# EAGLE design c64_mouse (EAGLE 9.6.2)
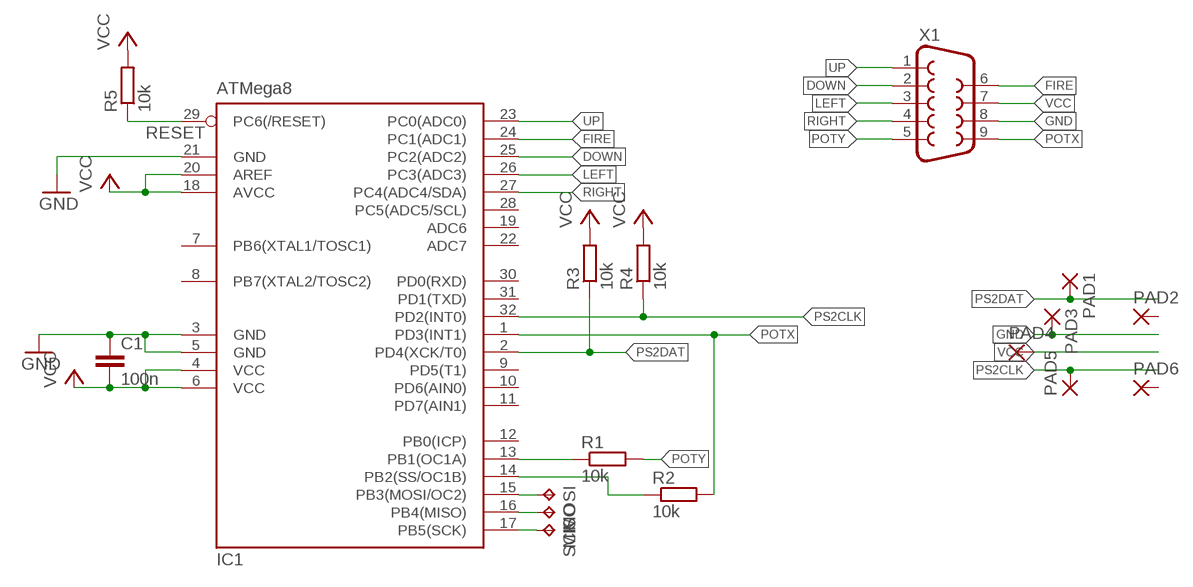
[diagram p0: schematic, sheet 1]

## Parts
C1  100n  C-EUC0805  [C0805]
IC1  ATMega8  MEGA8-AI  [TQFP32-08]
MISO  TPB1,27  [B1,27]
MOSI  TPB1,27  [B1,27]
PAD1  SMD2  [SMD1,27-2,54]
PAD2  SMD2  [SMD1,27-2,54]
PAD3  SMD2  [SMD1,27-2,54]
PAD4  SMD2  [SMD1,27-2,54]
PAD5  SMD2  [SMD1,27-2,54]
PAD6  SMD2  [SMD1,27-2,54]
R1  10k  R-EU_R0805  [R0805]
R2  10k  R-EU_R0805  [R0805]
R3  10k  R-EU_R0805  [R0805]
R4  10k  R-EU_R0805  [R0805]
R5  10k  R-EU_R0805  [R0805]
SCK  TPB1,27  [B1,27]
X1  F09D  [F09D]

## Nets
DOWN: IC1.25(PC2(ADC2)) X1.2
FIRE: IC1.24(PC1(ADC1)) X1.6
GND: C1.1 IC1.3(GND) IC1.5(GND) IC1.21(GND) PAD3.1(P) X1.8
LEFT: IC1.26(PC3(ADC3)) X1.3
N$2: IC1.15(PB3(MOSI/OC2)) MOSI.TP
N$3: IC1.16(PB4(MISO)) MISO.TP
N$4: IC1.17(PB5(SCK)) SCK.TP
N$7: IC1.13(PB1(OC1A)) R1.1
N$8: IC1.14(PB2(SS/OC1B)) R2.1
POTX: IC1.1(PD3(INT1)) R2.2 X1.9
POTY: R1.2 X1.5
PS2CLK: IC1.32(PD2(INT0)) PAD5.1(P) R4.1
PS2DAT: IC1.2(PD4(XCK/T0)) PAD1.1(P) R3.1
RESET: IC1.29(PC6(/RESET)) R5.1
RIGHT: IC1.27(PC4(ADC4/SDA)) X1.4
UP: IC1.23(PC0(ADC0)) X1.1
VCC: C1.2 IC1.4(VCC) IC1.6(VCC) IC1.18(AVCC) IC1.20(AREF) PAD4.1(P) R3.2 R4.2 R5.2 X1.7
Unconnected: IC1.7(PB6(XTAL1/TOSC1)) IC1.8(PB7(XTAL2/TOSC2)) IC1.9(PD5(T1)) IC1.10(PD6(AIN0)) IC1.11(PD7(AIN1)) IC1.12(PB0(ICP)) IC1.19(ADC6) IC1.22(ADC7) IC1.28(PC5(ADC5/SCL)) IC1.30(PD0(RXD)) IC1.31(PD1(TXD)) PAD2.1(P) PAD6.1(P)

## Library data of the parts
C1 = rcl:C-EU: CAPACITOR, European symbol; SPICEPREFIX: C
IC1 = atmel:MEGA8: MICROCONTROLLER 8 Kbytes FLASH, 1 kbytes SRAM, 512 bytes EEPROM, USART, 6-channel 10 bit ADC, 2-channel 8 bit ADC Pin compatible with Atmega48, ATMega88, ATMega168 Source: avr.lbr; MPN: ATMEGA8-16AU; OC_FARNELL: 9171371; OC_NEWARK: 73M8863
MISO MOSI SCK = testpad:TP: Test pad
PAD1-PAD6 = wirepad:SMD2: SMD PAD
R1-R5 = rcl:R-EU_: RESISTOR, European symbol; SPICEPREFIX: R
X1 = con-subd-edit:F09: SUB-D; OC_FARNELL: unknown; OC_NEWARK: unknown

## Board
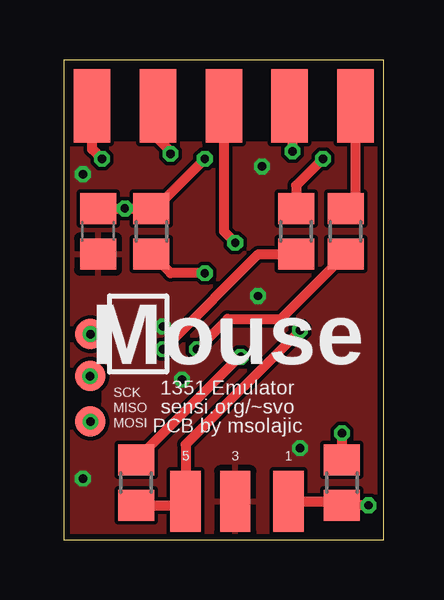
[diagram p1: board, top side]
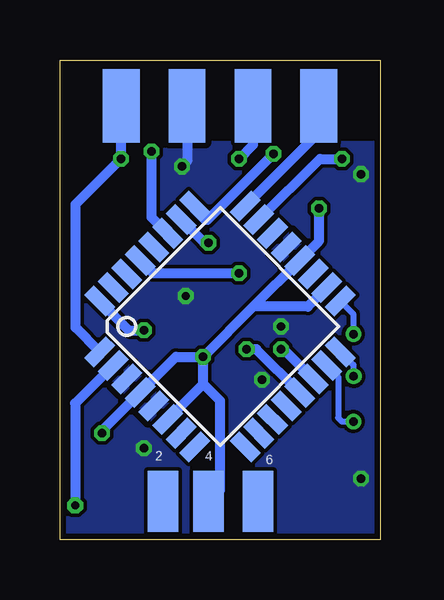
[diagram p2: board, bottom side, seen from below]

Size 13.34 x 20 mm. Coordinates in mm from the lower left corner, seen from the top.
Outline: 0,0 13.34,0 13.34,20 0,20 0,0
Copper layers (1*16): Top 0.035mm / dielectric 1.5mm / Bottom 0.035mm
Design rules "SeeedStudio_2layer_DRU_no_angle_20140221": minimum track width 6mil, minimum drill 12mil, track to track 6mil, track to pad 6mil, pad to pad 6mil, via to via 6mil, smd to smd 0mil, copper to edge 10mil, drill to drill 10mil, minimum pad ring 10mil, minimum via ring 6mil, stop-mask expansion 2mil, vias tented up to drill 100mil, thermal gap 10mil
tRestrict: area 0.2,5.2 to 1.4,6.5

### Footprints (pad centres in the part's own frame; a part is rotated, then mirrored left to right if it is on the bottom)
C0805 = smd 1.3 x 1.5: 1 -0.95,0; 2 0.95,0
TQFP32-08 = smd 1.27 x 0.559: 1 -4.293,2.8; 2 -4.293,2; 3 -4.293,1.2; 4 -4.293,0.4; 5 -4.293,-0.4; 6 -4.293,-1.2; 7 -4.293,-2; 8 -4.293,-2.8; 17 4.293,-2.8; 18 4.293,-2; 19 4.293,-1.2; 20 4.293,-0.4; 21 4.293,0.4; 22 4.293,1.2; 23 4.293,2; 24 4.293,2.8 | smd 0.559 x 1.27: 9 -2.8,-4.293; 10 -2,-4.293; 11 -1.2,-4.293; 12 -0.4,-4.293; 13 0.4,-4.293; 14 1.2,-4.293; 15 2,-4.293; 16 2.8,-4.293; 25 2.8,4.293; 26 2,4.293; 27 1.2,4.293; 28 0.4,4.293; 29 -0.4,4.293; 30 -1.2,4.293; 31 -2,4.293; 32 -2.8,4.293
B1,27 = smd 1.27 x 1.27: TP 0,0
SMD1,27-2,54 = smd 1.27 x 2.54: 1 0,0
R0805 = smd 1.3 x 1.5: 1 -0.95,0; 2 0.95,0
F09D = smd 1.524 x 3.048: 1 -5.486,-6.045; 2 -2.743,-6.045; 3 0,-6.045; 4 2.743,-6.045; 5 5.486,-6.045 | smd 1.524 x 3.048 bottom: 6 -4.115,-6.045; 7 -1.372,-6.045; 8 1.372,-6.045; 9 4.115,-6.045

### Placement (x,y rotation side)
C1  1.43,12.86 90 top
IC1  6.67,8.89 45 bottom
MISO  1.11,6.83 0 top
MOSI  1.11,4.92 0 top
PAD1  9.37,1.59 0 top
PAD2  9.05,1.59 0 bottom
PAD3  7.14,1.59 0 top
PAD4  7.14,1.59 0 bottom
PAD5  5.08,1.59 0 top
PAD6  5.08,1.59 0 bottom
R1  11.75,12.86 90 top
R2  9.68,12.86 90 top
R3  11.59,2.38 90 top
R4  3.02,2.38 90 top
R5  3.65,12.86 90 top
SCK  1.11,8.57 0 top
X1  6.67,24.13 0 top

### Tracks (layer width: path | path; a pad name or v marks a point on that pad's centre or on a via)
DOWN  (via drill 0.35)
  Top 0.406: X1.2 3.92,16.71 4.45,16.19 v4.45,16.08
  Bottom 0.406: v4.45,16.08 7.18,13.34 7.3,13.34 7.72,13.77 IC1.25
FIRE
  Bottom 0.406: IC1.24 2.55,16.96 X1.6
GND  (via drill 0.35)
  Bottom 0.406: X1.8 8.04,15.77 v8.26,15.56
  other vias: 4.13,8.89 9.84,3.81 4.92,6.67 0.79,2.54 8.1,10.16 0.79,15.24
  pour Bottom: -0.95,16.51 13.97,16.51 13.97,-0.64 -0.95,-0.64
  pour Top: -0.32,16.51 14.61,16.51 14.61,-0.64 -0.32,-0.64
LEFT  (via drill 0.35)
  Top 0.406: X1.3 6.67,12.86 v7.14,12.38
  Bottom 0.406: IC1.26 7.33,12.38 v7.14,12.38
N$2  (via drill 0.35)
  Bottom 0.254: IC1.15 1.75,6.8 1.75,5.08 1.59,4.92 MOSI.TP
  other vias: 1.11,4.92
N$3  (via drill 0.35)
  Top 0.254: v1.1,6.81 | v1.1,6.81 MISO.TP
  Bottom 0.254: IC1.16 1.11,7.29 MISO.TP v1.1,6.81 | v1.1,6.81
N$4  (via drill 0.35)
  Bottom 0.254: IC1.17 1.11,9.4 SCK.TP
  other vias: 1.11,8.57
N$7  (via drill 0.35)
  Top 0.406: v5.56,7.94 6.83,9.21 9.05,9.21 R1.1
  Bottom 0.406: IC1.13 5.15,7.94 v5.56,7.94
N$8  (via drill 0.35)
  Top 0.406: v4.13,7.94 4.4,8.21 4.41,8.21 8.11,11.91 R2.1
  Bottom 0.406: IC1.14 4.02,7.94 v4.13,7.94
POTX  (via drill 0.35)
  Top 0.406: v10.79,15.88 9.68,14.76 R2.2
  Bottom 0.406: X1.9 10.79,18.07 v10.79,15.88 12.69,13.98 12.69,8.84 IC1.1
POTY
  Top 0.406: X1.5 12.15,14.21 R1.2
PS2CLK  (via drill 0.35)
  Top 0.406: v9.84,8.73 5.08,3.97 PAD5.1 4.92,1.43 R4.1
  Bottom 0.406: IC1.32 10.47,8.73 v9.84,8.73
PS2DAT  (via drill 0.35)
  Top 0.406: PAD1.1 11.43,1.59 R3.1 v12.7,1.43
  Bottom 0.406: IC1.2 12.7,5.69 v12.7,1.43
RESET  (via drill 0.35)
  Top 0.406: v5.87,11.11 4.45,11.11 R5.1
  Bottom 0.406: IC1.29 9.46,11.11 v5.87,11.11
RIGHT  (via drill 0.35)
  Top 0.406: X1.4 9.53,17.97 v9.53,16.19
  Bottom 0.406: v9.53,16.19 9.53,13.45 IC1.27
UP  (via drill 0.35)
  Top 0.406: v1.59,15.88 1.18,16.28 X1.1
  Bottom 0.406: IC1.23 2.51,15.88 v1.59,15.88
VCC  (via drill 0.35)
  Top 0.406: C1.2 v2.54,13.81 R5.2 3.81,13.81 v5.87,15.88 | v11.59,4.45 R3.2 | R4.2 7.3,7.62 v7.37,7.62
  Bottom 0.406: 5.27,9.72 IC1.20 2.54,12.45 v2.54,13.81 | 5.27,9.72 v7.37,7.62 | 9.99,6.21 IC1.4 | IC1.6 7.37,6.49 | 7.37,6.49 v7.37,7.62 | PAD4.1 6.67,2.06 6.67,5.78 7.37,6.49 | IC1.18 3.01,9.72 5.27,9.72 | IC1.4 8.5,7.62 v7.37,7.62 | IC1.4 11.59,4.53 v11.59,4.45 | X1.7 5.3,16.45 v5.87,15.88

### Text on the board
tNames: Mouse | 1351 Emulator / sensi.org/~svo / PCB by msolajic | 5 | 3 | 1
bNames: 6 | 4 | 2